# EAGLE design power-slot (EAGLE 9.5.1)
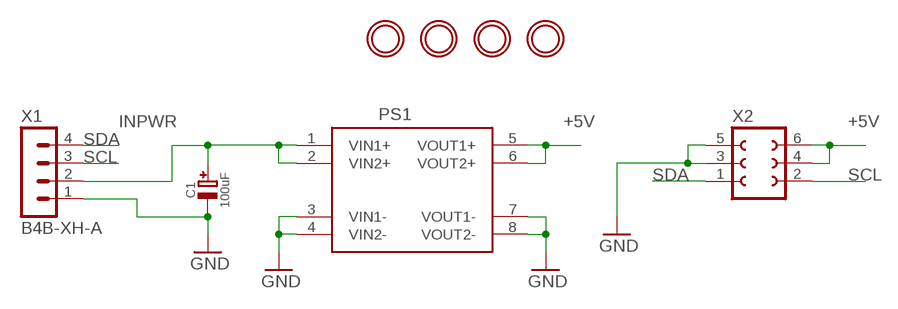
[diagram p0: schematic, sheet 1]

## Parts
C1  100uF  CAP_ELECTROLYTICPTH_3.5MMGRID_8MMDIA  [CELEC_3.5MM_8MM]
PS1  K8801MODULE  [K8801]
U$1  MOUNTINGHOLE2.7THIN  [MOUNTINGHOLE_2.7_PLATEDTHIN]
U$2  MOUNTINGHOLE2.7THIN  [MOUNTINGHOLE_2.7_PLATEDTHIN]
U$3  MOUNTINGHOLE2.7THIN  [MOUNTINGHOLE_2.7_PLATEDTHIN]
U$4  MOUNTINGHOLE2.7THIN  [MOUNTINGHOLE_2.7_PLATEDTHIN]
X1  B4B-XH-A  [B4B-XH-A]
X2  CON-FE03-2CARDEDGE-0.1  [FE3-2-CARDEDGE-0.1]

## Nets
+5V: PS1.5(VOUT1+) PS1.6(VOUT2+) X2.4 X2.6
GND: C1.- PS1.3(VIN1-) PS1.4(VIN2-) PS1.7(VOUT1-) PS1.8(VOUT2-) X1.1 X2.3 X2.5
INPWR: C1.+ PS1.1(VIN1+) PS1.2(VIN2+) X1.2
SCL: X1.3 X2.2
SDA: X1.4 X2.1

## Library data of the parts
C1 = sanisimov:CAP_ELECTROLYTIC: Electrolytic Capacitors SMT PANASONIC_C - Size C Panasonic Electrolytic Aluminum Capacitor 47µF 16V 20% Electrolytic Capacitor [Digikey: PCE3890TR-ND] PANASONIC_D - Size D Panasonic Electrolytic Aluminum Capacitor 100µF 25V 20% Electrolytic Capacitor [Digikey: PCE3898TR-ND] PTH 3.5 mm grid, 8 mm diameter ... 3.5 mm grid, 10 mm diameter ...
PS1 = sanisimov:K8801: 7V-28V to 5V DC-DC Step Down Power Supply Module Voltage Buck Converter 3A Power Supply Board Input voltage:DC 7V-28V Output valtage:DC 5V Output current:3A. max(2A for long time) Working frequency:570KHz Size:22*17.8*5mm
U$1-U$4 = sanisimov:MOUNTINGHOLE: Mounting Hole For #2 screws (0.086"/2.18mm width, 0.094"/2.4mm hole) use 2.5mm; BOM: EXCLUDE
X1 = sanisimov:B4B-XH: JST XH series header 2.50mm pitch disconnectable crimp style connectors, vertical (side entry type), 4 pins
X2 = sanisimov:CON-FE03-2: FEMALE HEADER

## Board
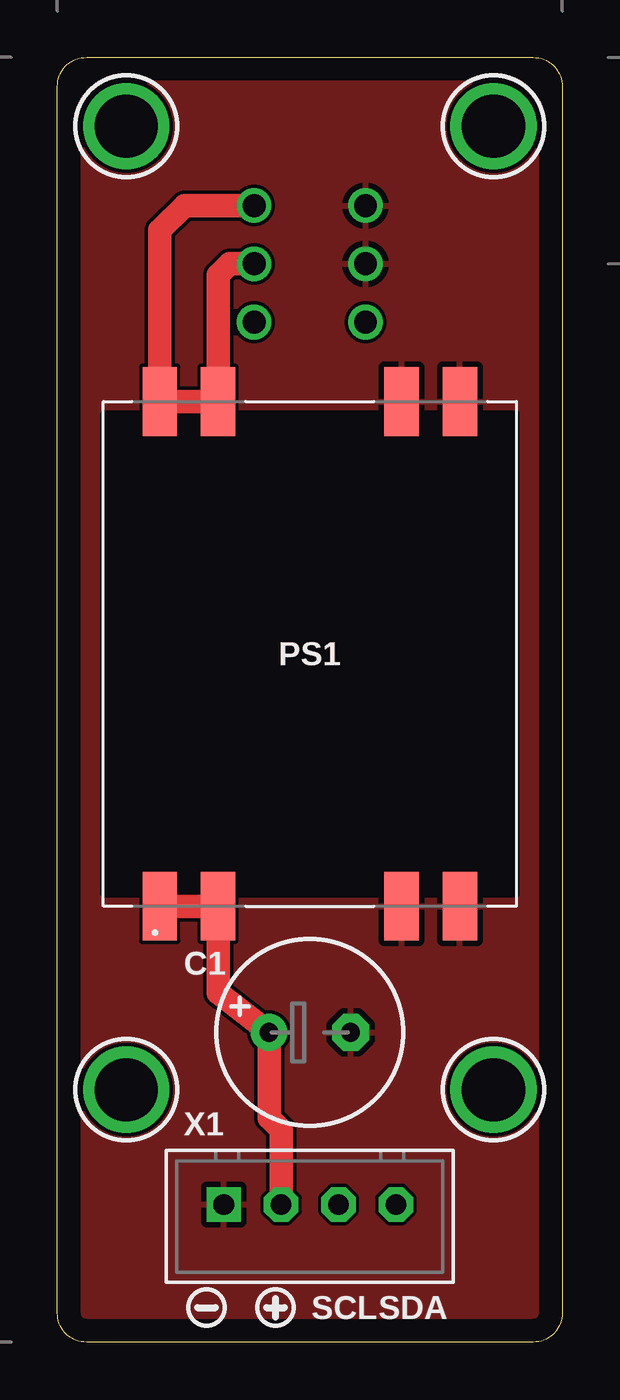
[diagram p1: board, top side]
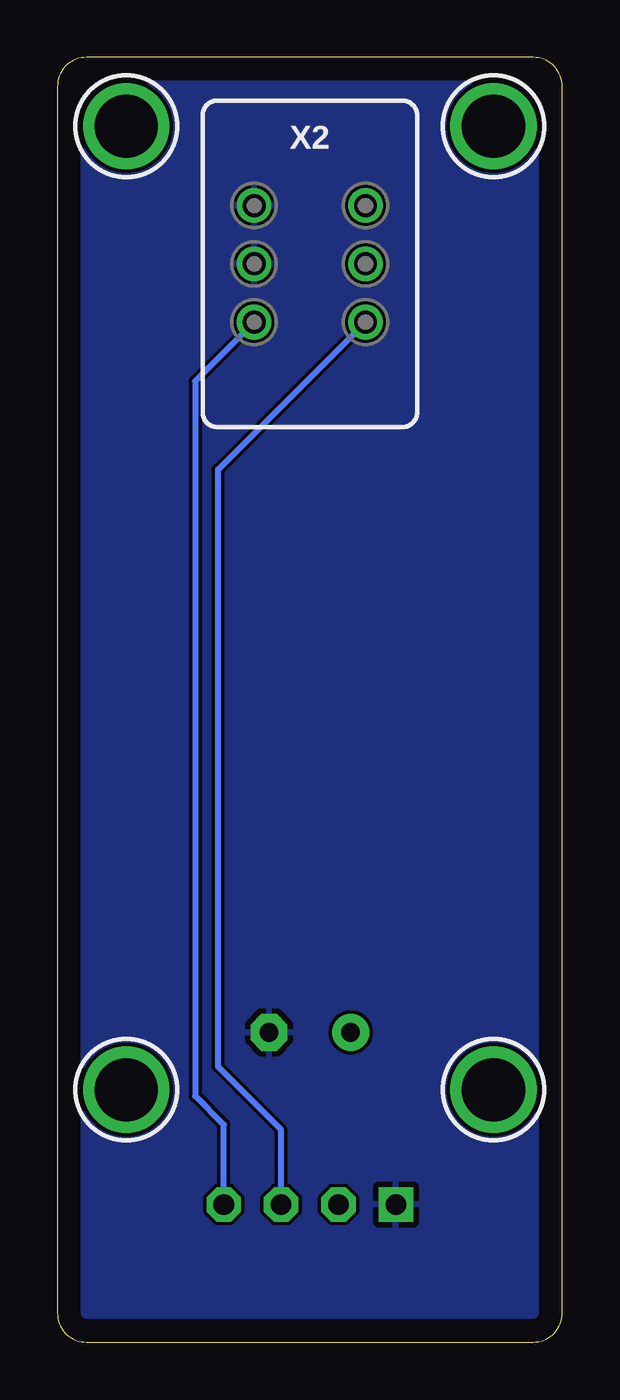
[diagram p2: board, bottom side, seen from below]

Size 22 x 56 mm. Coordinates in mm from the lower left corner, seen from the top.
Outline: 1.27,56 20.73,56 arc-90 22,54.73 22,1.27 arc-90 20.73,0 1.27,0 arc-90 0,1.27 0,54.73 arc-90 1.27,56
Copper layers (1*16): Top 0.035mm / dielectric 1.5mm / Bottom 0.035mm
Design rules "default *": minimum track width 6mil, minimum drill 0.35mm, track to track 6mil, track to pad 6mil, pad to pad 6mil, via to via 6mil, smd to smd 6mil, copper to edge 40mil, drill to drill 6mil, minimum pad ring 10mil, minimum via ring 8mil, stop-mask expansion 4mil, vias tented up to drill 15mil, thermal gap 10mil

### Footprints (pad centres in the part's own frame; a part is rotated, then mirrored left to right if it is on the bottom)
CELEC_3.5MM_8MM = drill 0.813 pad 1.6: + -1.778,0 | drill 0.813 pad 1.6 octagon: - 1.778,0
K8801 = smd 1.5 x 3: 1 -6.54,-11; 2 -4,-11; 3 4,-11; 4 6.54,-11; 5 -6.54,11; 6 -4,11; 7 4,11; 8 6.54,11
MOUNTINGHOLE_2.7_PLATEDTHIN = drill 2.75 pad 3.5: P$1 0,0
B4B-XH-A = drill 0.9 pad 1.5 square: 1 3.75,0 | drill 0.9 pad 1.5 octagon: 2 1.25,0; 3 -1.25,0; 4 -3.75,0
FE3-2-CARDEDGE-0.1 = drill 1: 1 -2.54,2.426; 2 -2.54,-2.426; 3 0,2.426; 4 0,-2.426; 5 2.54,2.426; 6 2.54,-2.426

### Placement (x,y rotation side)
C1  11,13.5 0 top
PS1  11,30 0 top
U$1  3,53 0 top
U$2  19,53 0 top
U$3  19,11 0 top
U$4  3,11 0 top
U$5  [SYMBOL_PLUS]  9.5,1.5 90 top
U$6  [SYMBOL_MINUS]  6.5,1.5 180 top
X1  11,6 180 top
X2  11,47 90 bottom

### Tracks (layer width: path | path; a pad name or v marks a point on that pad's centre or on a via)
+5V
  Top 1.016: X2.6 5.54,49.54 4.46,48.46 PS1.5 PS1.6 7,46.5 7.5,47 X2.4
GND
  pour Top: -1,57 23,57 23,-1 -1,-1
  pour Bottom: -1,57 23,57 23,-1 -1,-1
  cutout Top: 2,40.5 20,40.5 20,19.5 2,19.5
INPWR
  Top 1.016: PS1.1 PS1.2 7,15.22 C1.+ 9.22,9.78 9.75,9.25 X1.2
SCL
  Bottom 0.254: X2.2 15,38.03 15,12 12.25,9.25 X1.3
SDA
  Bottom 0.254: X2.1 16,41.89 16,10.72 14.75,9.47 X1.4

### Text on the board
tPlace: SCL | SDA